# EAGLE design Stenophone (EAGLE 7.4.0)
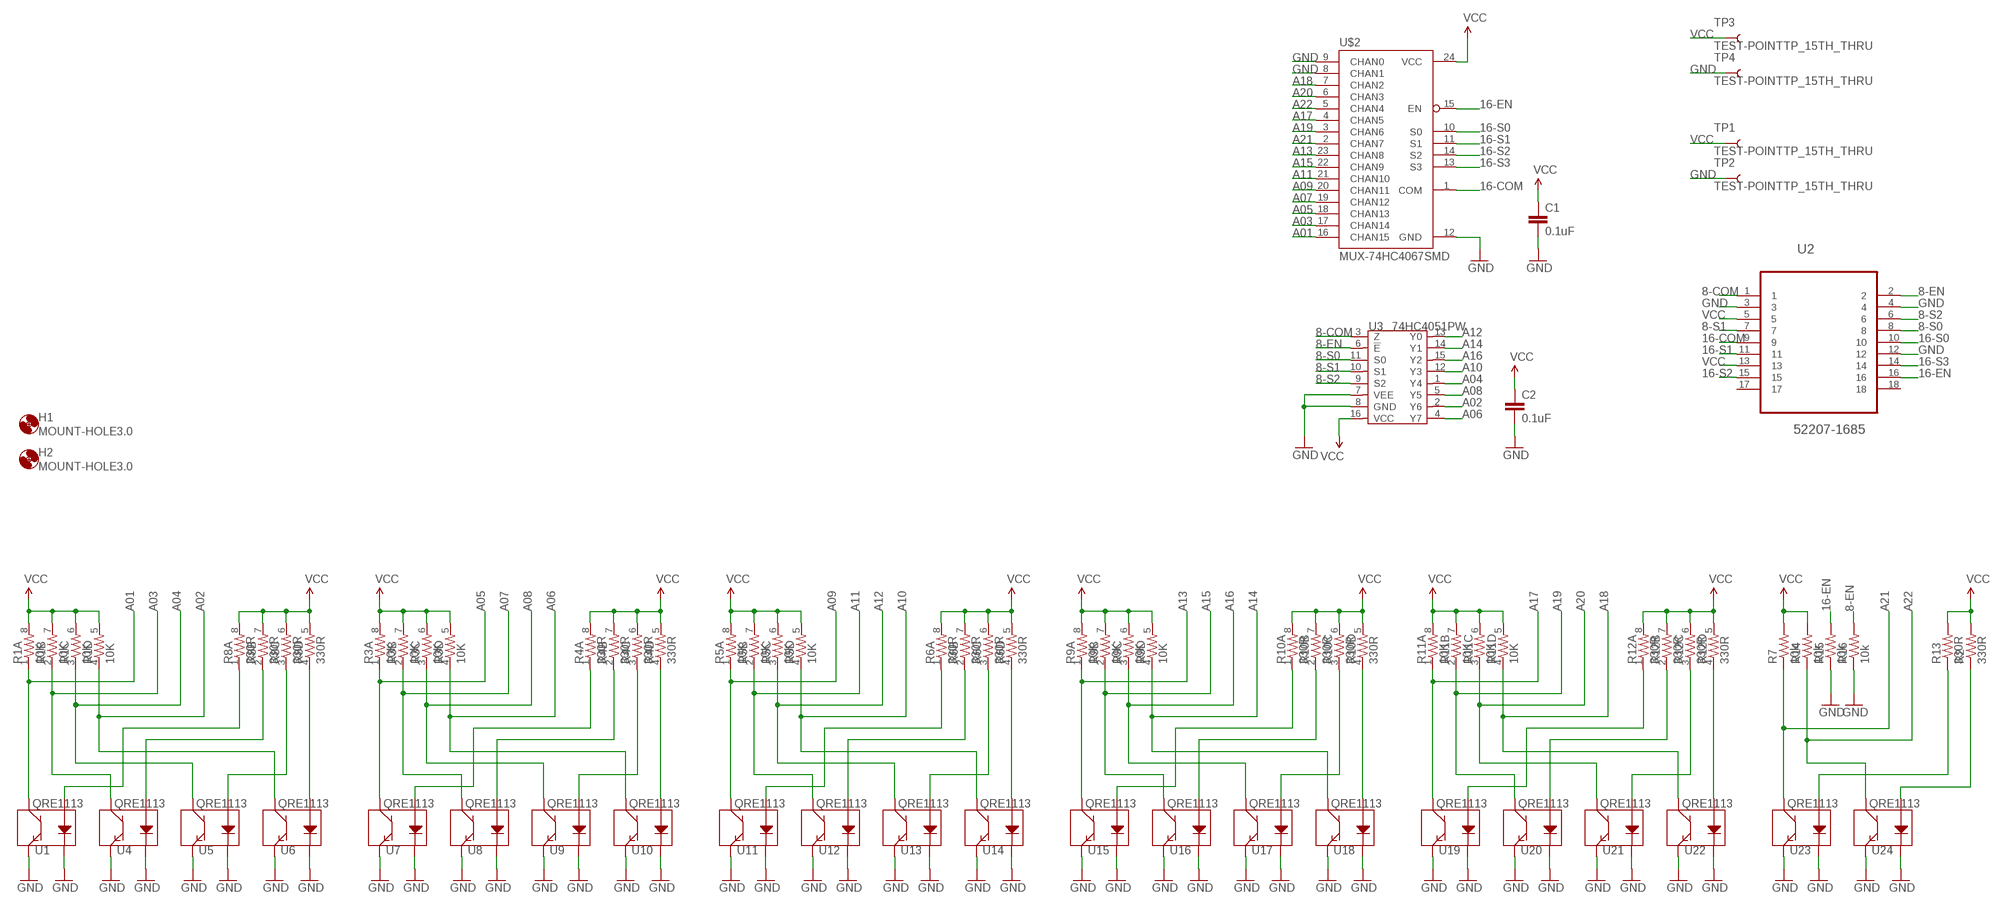
[diagram p0: schematic, sheet 1]

## Parts
C1  0.1uF  CAP0603-CAP  [0603-CAP]
C2  0.1uF  CAP0603-CAP  [0603-CAP]
H1  MOUNT-HOLE3.0  [3,0]
H2  MOUNT-HOLE3.0  [3,0]
R1  10K  RESISTOR-ARRAY0603-ARV  [0603-ARV]
R2  330R  RESISTOR0603-RES  [0603-RES]
R3  10K  RESISTOR-ARRAY0603-ARV  [0603-ARV]
R4  330R  RESISTOR-ARRAY0603-ARV  [0603-ARV]
R5  10K  RESISTOR-ARRAY0603-ARV  [0603-ARV]
R6  330R  RESISTOR-ARRAY0603-ARV  [0603-ARV]
R7  10k  RESISTOR0603-RES  [0603-RES]
R8  330R  RESISTOR-ARRAY0603-ARV  [0603-ARV]
R9  10K  RESISTOR-ARRAY0603-ARV  [0603-ARV]
R10  330R  RESISTOR-ARRAY0603-ARV  [0603-ARV]
R11  10K  RESISTOR-ARRAY0603-ARV  [0603-ARV]
R12  330R  RESISTOR-ARRAY0603-ARV  [0603-ARV]
R13  330R  RESISTOR0603-RES  [0603-RES]
R14  10k  RESISTOR0603-RES  [0603-RES]
R15  10k  RESISTOR0603-RES  [0603-RES]
R16  10k  RESISTOR0603-RES  [0603-RES]
TP1  TEST-POINTTP_15TH_THRU  [TP_15TH]
TP2  TEST-POINTTP_15TH_THRU  [TP_15TH]
TP3  TEST-POINTTP_15TH_THRU  [TP_15TH]
TP4  TEST-POINTTP_15TH_THRU  [TP_15TH]
U1  QRE1113  [QRE1113]
U2  52207-1685  [MOLEX_52207-1685]
U3  74HC4051PW  [TSSOP16-6.6]
U4  QRE1113  [QRE1113]
U5  QRE1113  [QRE1113]
U6  QRE1113  [QRE1113]
U7  QRE1113  [QRE1113]
U8  QRE1113  [QRE1113]
U9  QRE1113  [QRE1113]
U10  QRE1113  [QRE1113]
U11  QRE1113  [QRE1113]
U12  QRE1113  [QRE1113]
U13  QRE1113  [QRE1113]
U14  QRE1113  [QRE1113]
U15  QRE1113  [QRE1113]
U16  QRE1113  [QRE1113]
U17  QRE1113  [QRE1113]
U18  QRE1113  [QRE1113]
U19  QRE1113  [QRE1113]
U20  QRE1113  [QRE1113]
U21  QRE1113  [QRE1113]
U22  QRE1113  [QRE1113]
U23  QRE1113  [QRE1113]
U24  QRE1113  [QRE1113]
U$2  MUX-74HC4067SMD  [SSOP24]

## Nets
8-COM: U2.1 U3.3(Z)
8-EN: R16.2 U2.2 U3.6(!E)
8-S0: U2.8 U3.11(S0)
8-S1: U2.7 U3.10(S1)
8-S2: U2.6 U3.9(S2)
16-COM: U2.9 U$2.1(COM)
16-EN: R15.2 U2.16 U$2.15(EN)
16-S0: U2.10 U$2.10(S0)
16-S1: U2.11 U$2.11(S1)
16-S2: U2.15 U$2.14(S2)
16-S3: U2.14 U$2.13(S3)
A01: R1.1 U1.3(C) U$2.16(CHAN15)
A02: R1.4 U3.2(Y6) U6.3(C)
A03: R1.2 U4.3(C) U$2.17(CHAN14)
A04: R1.3 U3.1(Y4) U5.3(C)
A05: R3.1 U7.3(C) U$2.18(CHAN13)
A06: R3.4 U3.4(Y7) U10.3(C)
A07: R3.2 U8.3(C) U$2.19(CHAN12)
A08: R3.3 U3.5(Y5) U9.3(C)
A09: R5.1 U11.3(C) U$2.20(CHAN11)
A10: R5.4 U3.12(Y3) U14.3(C)
A11: R5.2 U12.3(C) U$2.21(CHAN10)
A12: R5.3 U3.13(Y0) U13.3(C)
A13: R9.1 U15.3(C) U$2.23(CHAN8)
A14: R9.4 U3.14(Y1) U18.3(C)
A15: R9.2 U16.3(C) U$2.22(CHAN9)
A16: R9.3 U3.15(Y2) U17.3(C)
A17: R11.1 U19.3(C) U$2.4(CHAN5)
A18: R11.4 U22.3(C) U$2.7(CHAN2)
A19: R11.2 U20.3(C) U$2.3(CHAN6)
A20: R11.3 U21.3(C) U$2.6(CHAN3)
A21: R7.1 U23.3(C) U$2.2(CHAN7)
A22: R14.1 U24.3(C) U$2.5(CHAN4)
GND: C1.2 C2.2 R15.1 R16.1 TP2.P$1 TP4.P$1 U1.2(K) U1.4(E) U2.3 U2.4 U2.12 U3.7(VEE) U3.8(GND) U4.2(K) U4.4(E) U5.2(K) U5.4(E) U6.2(K) U6.4(E) U7.2(K) U7.4(E) U8.2(K) U8.4(E) U9.2(K) U9.4(E) U10.2(K) U10.4(E) U11.2(K) U11.4(E) U12.2(K) U12.4(E) U13.2(K) U13.4(E) U14.2(K) U14.4(E) U15.2(K) U15.4(E) U16.2(K) U16.4(E) U17.2(K) U17.4(E) U18.2(K) U18.4(E) U19.2(K) U19.4(E) U20.2(K) U20.4(E) U21.2(K) U21.4(E) U22.2(K) U22.4(E) U23.2(K) U23.4(E) U24.2(K) U24.4(E) U$2.8(CHAN1) U$2.9(CHAN0) U$2.12(GND)
N$5: R8.4 U6.1(A)
N$6: R8.3 U5.1(A)
N$7: R8.1 U1.1(A)
N$8: R8.2 U4.1(A)
N$13: R4.4 U10.1(A)
N$14: R4.3 U9.1(A)
N$15: R4.1 U7.1(A)
N$16: R4.2 U8.1(A)
N$21: R6.4 U14.1(A)
N$22: R6.3 U13.1(A)
N$23: R6.1 U11.1(A)
N$24: R6.2 U12.1(A)
N$29: R10.4 U18.1(A)
N$30: R10.3 U17.1(A)
N$31: R10.1 U15.1(A)
N$32: R10.2 U16.1(A)
N$37: R12.4 U22.1(A)
N$38: R12.3 U21.1(A)
N$39: R12.1 U19.1(A)
N$40: R12.2 U20.1(A)
N$43: R2.1 U24.1(A)
N$44: R13.1 U23.1(A)
VCC: C1.1 C2.1 R1.5 R1.6 R1.7 R1.8 R2.2 R3.5 R3.6 R3.7 R3.8 R4.5 R4.6 R4.7 R4.8 R5.5 R5.6 R5.7 R5.8 R6.5 R6.6 R6.7 R6.8 R7.2 R8.5 R8.6 R8.7 R8.8 R9.5 R9.6 R9.7 R9.8 R10.5 R10.6 R10.7 R10.8 R11.5 R11.6 R11.7 R11.8 R12.5 R12.6 R12.7 R12.8 R13.2 R14.2 TP1.P$1 TP3.P$1 U2.5 U2.13 U3.16(VCC) U$2.24(VCC)
Unconnected: U2.17 U2.18

## Library data of the parts
C1 C2 = SparkFun-Passives:CAP: Capacitor Standard 0603 ceramic capacitor, and 0.1" leaded capacitor.
H1 H2 = holes:MOUNT-HOLE: MOUNTING HOLE with drill center marker
R1 R3-R6 R8-R12 = SparkFun-Passives:RESISTOR-ARRAY: Array Chip Resistor Source: RS Component / Phycomp
R2 R7 R13-R16 = SparkFun-Passives:RESISTOR: Resistor Basic schematic elements and footprints for 0603, 1206, and PTH resistors.
TP1-TP4 = SparkFun-Passives:TEST-POINT: Bare copper test points for troubleshooting or ICT
U1 U4-U24 = SparkFun-Sensors:QRE1113: Reflective object sensor; PROD_ID: IC-09357
U2 = Molex_By_element14_Batch_1:52207-1685: SOCKET FPC, SMT, 1MM, 16WAY; MPN: 52207-1685; OC_FARNELL: 1079941; OC_NEWARK: 66K6176; PACKAGE: SOCKET FPC, SMT, 1MM, 16WAY; SUPPLIER: Molex
U3 = IC:74*4051: 8-channel analog multiplexer/demultipliexer http://www.nxp.com/documents/data_sheet/74HC_HCT4051.pdf
U$2 = SparkFun-AnalogIC:MUX-74HC4067: 16-channel analog MUX; PROD_ID: IC-08252

## Board
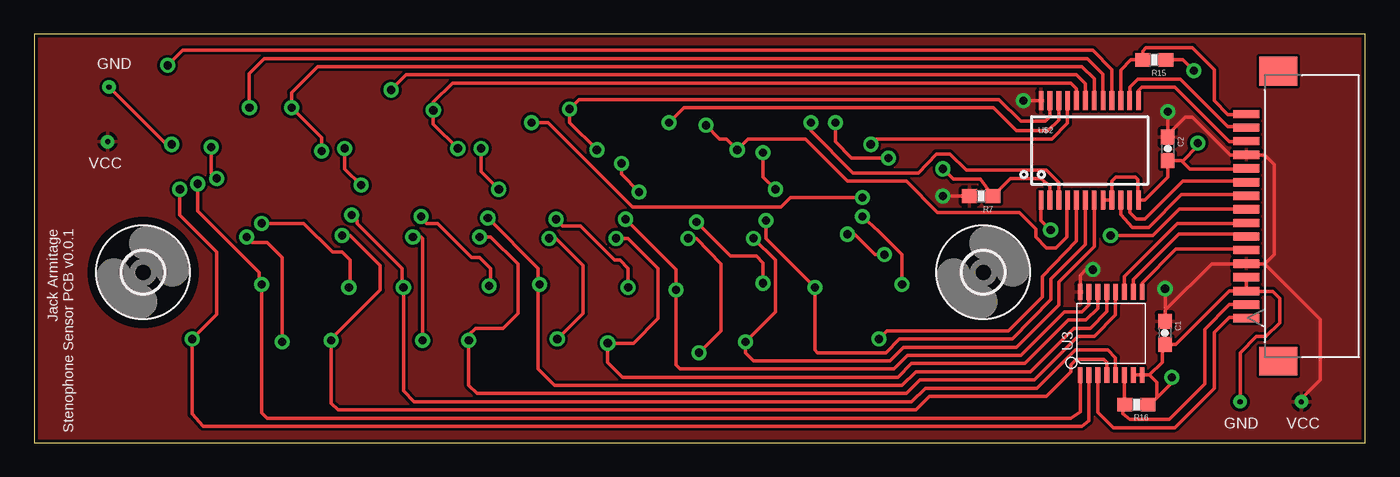
[diagram p1: board, top side]
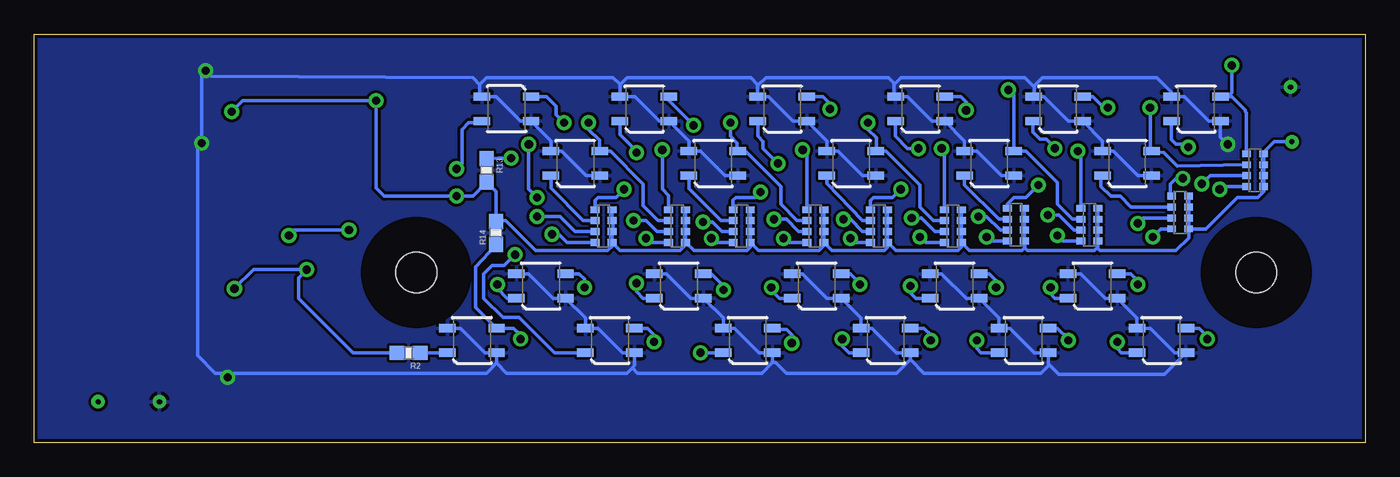
[diagram p2: board, bottom side, seen from below]

Size 97.7 x 30 mm. Coordinates in mm from the lower left corner, seen from the top.
Outline: 0,0 97.7,0 97.7,30 0,30 0,0
Copper layers (1*16): Top 0.035mm / dielectric 1.5mm / Bottom 0.035mm
Design rules "SparkFun": minimum track width 8mil, minimum drill 20mil, track to track 8mil, track to pad 8mil, pad to pad 8mil, via to via 8mil, smd to smd 8mil, copper to edge 10mil, drill to drill 8mil, minimum pad ring 12mil, minimum via ring 10mil, stop-mask expansion 4mil, vias tented up to drill 25mil, thermal gap 10mil

### Footprints (pad centres in the part's own frame; a part is rotated, then mirrored left to right if it is on the bottom)
0603-CAP = smd 1.1 x 1: 1 -0.85,0; 2 0.85,0
3,0 = hole 3: 0,0
0603-ARV = smd 0.5 x 0.65: 1 -1.2,-0.625; 2 -0.4,-0.625; 3 0.4,-0.625; 4 1.2,-0.625; 5 1.2,0.625; 6 0.4,0.625; 7 -0.4,0.625; 8 -1.2,0.625
0603-RES = smd 1.1 x 1: 1 -0.85,0; 2 0.85,0
TP_15TH = drill 0.381 pad 0.61: P$1 0,0
QRE1113 = smd 1.2 x 0.6: 1 -1.8,-0.9; 2 1.8,-0.9; 3 1.8,0.9; 4 -1.8,0.9
MOLEX_52207-1685 = smd 0.61 x 1.905: 1 7.493,4.801; 2 6.502,4.801; 3 5.512,4.801; 4 4.496,4.801; 5 3.505,4.801; 6 2.489,4.801; 7 1.499,4.801; 8 0.508,4.801; 9 -0.508,4.801; 10 -1.499,4.801; 11 -2.489,4.801; 12 -3.505,4.801; 13 -4.496,4.801; 14 -5.512,4.801; 15 -6.502,4.801; 16 -7.493,4.801 | smd 2.108 x 2.794: 17 -10.643,7.137; 18 10.643,7.137
TSSOP16-6.6 = smd 0.356 x 1.143: 1 -2.275,-3.052; 2 -1.625,-3.052; 3 -0.975,-3.052; 4 -0.325,-3.052; 5 0.325,-3.052; 6 0.975,-3.052; 7 1.625,-3.052; 8 2.275,-3.052; 9 2.275,3.052; 10 1.625,3.052; 11 0.975,3.052; 12 0.325,3.052; 13 -0.325,3.052; 14 -0.975,3.052; 15 -1.625,3.052; 16 -2.275,3.052
SSOP24 = smd 0.348 x 1.397: 1 -3.575,-3.656; 2 -2.925,-3.656; 3 -2.275,-3.656; 4 -1.625,-3.656; 5 -0.975,-3.656; 6 -0.325,-3.656; 7 0.325,-3.656; 8 0.975,-3.656; 9 1.625,-3.656; 10 2.275,-3.656; 11 2.925,-3.656; 12 3.575,-3.656; 13 3.575,3.656; 14 2.925,3.656; 15 2.275,3.656; 16 1.625,3.656; 17 0.975,3.656; 18 0.325,3.656; 19 -0.325,3.656; 20 -0.975,3.656; 21 -1.625,3.656; 22 -2.275,3.656; 23 -2.925,3.656; 24 -3.575,3.656

### Placement (x,y rotation side)
C1  82.99,8.06 270 top
C2  83.19,21.57 270 top
H1  69.65,12.5 0 top
H2  8,12.5 0 top
R1  8.1,20 270 bottom
R2  70.22,6.59 180 bottom
R3  20.25,16 270 bottom
R4  25.65,16 270 bottom
R5  30.27,15.9 270 bottom
R6  35.69,15.9 270 bottom
R7  69.5,18.1 180 top
R8  13.6,16.9 270 bottom
R9  40.37,15.9 270 bottom
R10  45.77,15.9 270 bottom
R11  50.51,15.9 270 bottom
R12  55.91,15.9 270 bottom
R13  64.49,19.99 270 bottom
R14  63.8,15.4 90 bottom
R15  82.2,28.1 180 top
R16  80.9,2.8 180 top
TP1  5.4,22.1 0 top
TP2  5.5,26.1 0 top
TP3  93,3 0 top
TP4  88.5,3 0 top
U1  12.43,24.5 0 bottom
U2  84.16,16.63 270 top
U3  79.04,8.01 0 top
U4  17.49,20.5 0 bottom
U5  20.02,11.5 0 bottom
U6  14.96,7.5 0 bottom
U7  22.55,24.5 0 bottom
U8  27.61,20.5 0 bottom
U9  30.14,11.5 0 bottom
U10  25.08,7.5 0 bottom
U11  32.67,24.5 0 bottom
U12  37.73,20.5 0 bottom
U13  40.26,11.5 0 bottom
U14  35.2,7.5 0 bottom
U15  42.79,24.5 0 bottom
U16  47.85,20.5 0 bottom
U17  50.38,11.5 0 bottom
U18  45.32,7.5 0 bottom
U19  52.91,24.5 0 bottom
U20  57.97,20.5 0 bottom
U21  60.5,11.5 0 bottom
U22  55.44,7.5 0 bottom
U23  63.03,24.5 180 bottom
U24  65.56,7.5 0 bottom
U$2  77.47,21.45 0 top

### Tracks (layer width: path | path; a pad name or v marks a point on that pad's centre or on a via)
8-COM
  Top 0.25: U3.3 78.06,2.23 79.2,1.1 83.7,1.1 86.6,4 86.6,8.1 87.7,9.2 88.9,9.2 U2.1
8-EN
  Top 0.25: U3.6 80.02,2.83 R16.2 79.9,2.65 79.9,2.1 80.4,1.7 83.3,1.7 85.9,4.3 85.9,8.3 87.73,10.13 U2.2
8-S0
  Top 0.25: U3.11 80.02,12.21 83.9,16.1 88.94,16.1 U2.8
8-S1
  Top 0.25: U3.10 80.67,11.96 84,15.3 88.79,15.3 U2.7
8-S2
  Top 0.25: U3.9 81.31,11.71 83.8,14.2 88.9,14.2 U2.6
16-COM  (via drill 0.6 pad 0.4)
  Top 0.25: U2.9 84.04,17.14 82.1,15.2 v79,15.2 | U$2.1 73.89,16.41 73.9,16.3 v74.6,15.6
  Bottom 0.25: v74.6,15.6 78.6,15.6 v79,15.2
16-EN
  Top 0.25: U$2.15 79.75,27.34 80.5,28.1 R15.2 81.35,28.75 81.6,29 85,29 86.6,27.4 86.6,25.1 87.6,24.1 88.94,24.1 U2.16
16-S0
  Top 0.25: U$2.10 79.75,16.75 80.6,15.8 81.8,15.8 84.2,18.2 88.89,18.2 U2.10
16-S1
  Top 0.25: U$2.11 80.39,16.91 80.9,16.4 81.5,16.4 84.3,19.2 88.88,19.2 U2.11
16-S2
  Top 0.25: U$2.14 80.39,26.09 81,26.7 84.1,26.7 87.6,23.2 88.89,23.2 U2.15
16-S3
  Top 0.25: U$2.13 81.05,25.84 81.3,26.1 83.7,26.1 87.7,22.1 88.92,22.1 U2.14
A01  (via drill 0.6 pad 0.4)
  Top 0.25: U$2.16 79.1,27.4 77.7,28.8 10.9,28.8 v9.8,27.7
  Bottom 0.25: R1.1 8.72,24.23 8.8,24.3 8.8,24.4 9.8,25.4 10.1,25.4 | 10.1,25.4 U1.3 | v9.8,27.7 9.8,25.7 10.1,25.4
A02  (via drill 0.6 pad 0.4)
  Top 0.25: U3.2 77.4,4.96 77.4,1.6 76.9,1.2 12.4,1.2 11.6,2.1 v11.6,7.6 | v11.6,7.6 11.6,7.4 | v10.7,18.6 10.7,16.7 13.4,14 13.4,9.4 v11.6,7.6
  Bottom 0.25: U6.3 12.2,8.4 11.6,7.8 v11.6,7.6 | R1.4 10.5,18.8 v10.7,18.6
A03  (via drill 0.6 pad 0.4)
  Top 0.25: U$2.17 78.44,27.05 77.3,28.2 16.9,28.2 15.8,27.1 v15.8,24.6
  Bottom 0.25: R1.2 13.8,20.3 14.8,21.3 U4.3 15.8,21.51 v15.8,24.6
A04  (via drill 0.6 pad 0.4)
  Top 0.25: U3.1 76.77,2.27 76.1,1.8 17.1,1.8 16.7,2.2 v16.7,11.6 | v16.7,11.6 16.7,11.4 | v12,19 12,17 16.5,12.5 16.5,11.8 v16.7,11.6
  Bottom 0.25: U5.3 17.2,12.4 16.7,11.9 v16.7,11.6 | R1.3 11.4,19.6 v12,19
A05  (via drill 0.6 pad 0.4)
  Top 0.25: U$2.18 77.8,26.7 76.9,27.6 20.8,27.6 18.9,25.7 v18.9,24.6 21.1,22.4 v21.1,21.4
  Bottom 0.25: v18.9,24.6 19.2,24.6 20,25.4 U7.3 | R3.1 20.88,21.18 v21.1,21.4
A06  (via drill 0.6 pad 0.4)
  Top 0.25: U3.4 78.72,5.88 78.5,6.1 76.5,6.1 76.1,5.7 76.1,5.2 74.3,3.4 65.7,3.4 64.7,2.4 22.3,2.4 21.8,2.9 v21.8,7.5 21.8,7.6 25.4,11.2 25.4,13 23.2,15.2 v22.6,15.2
  Bottom 0.25: R3.4 22.2,14.8 v22.6,15.2 | U10.3 22.6,8.4 21.8,7.6 v21.8,7.5
A07  (via drill 0.6 pad 0.4)
  Top 0.25: U$2.19 77.14,26.36 76.5,27 27.3,27 v26.2,25.9
  Bottom 0.25: R3.2 21.5,16.4 22.6,17.5 22.6,19.1 24.9,21.4 U8.3 25.8,21.41 25.8,25.5 v26.2,25.9
A08  (via drill 0.6 pad 0.4)
  Top 0.25: U3.5 79.36,6.24 78.8,6.8 76.4,6.8 73.6,4 65.4,4 64.4,3 27.9,3 27.1,3.8 v27.1,11.4 | v23.3,16.7 23.7,16.3 23.7,16.1 27,12.8 27,11.5 v27.1,11.4 | v27.1,11.4 27.1,11.1
  Bottom 0.25: R3.3 21.4,15.6 22.5,16.7 v23.3,16.7 | U9.3 27.6,12.4 27.1,11.9 v27.1,11.4
A09  (via drill 0.6 pad 0.4)
  Top 0.25: U$2.20 76.5,26 76.1,26.4 30.7,26.4 29.3,25 v29.3,24.4 29.3,23.4 v31.1,21.6
  Bottom 0.25: R5.1 30.89,21.39 v31.1,21.6 | v29.3,24.4 29.3,25 29.7,25.4 U11.3
A10  (via drill 0.6 pad 0.4)
  Top 0.25: U3.12 79.36,9.37 77.8,7.8 76.6,7.8 73.4,4.6 65,4.6 64,3.6 32.5,3.6 31.9,4.2 v31.9,7.5 31.9,7.9 32.4,8.4 34.4,8.4 35.5,9.5 35.5,13.1 33.5,15.1 v32.7,15.1
  Bottom 0.25: R5.4 32.3,14.7 v32.7,15.1 | U14.3 32.4,8.4 31.9,7.9 v31.9,7.5
A11  (via drill 0.6 pad 0.4)
  Top 0.25: U$2.21 75.84,23.45 74.7,22.3 61.8,22.3 v61.4,21.9 | v60.8,18 55.5,18 54.8,17.3 43.9,17.3 37.7,23.5 v36.5,23.5
  Bottom 0.25: R5.2 31.7,16.3 32.7,17.3 32.7,18.9 35.2,21.4 U12.3 35.9,21.43 35.9,22.4 36.5,23 v36.5,23.5 | v61.4,21.9 61.4,18.6 v60.8,18
A12  (via drill 0.6 pad 0.4)
  Top 0.25: U3.13 78.72,9.62 77.5,8.4 76.3,8.4 73.1,5.2 64.7,5.2 63.7,4.2 38.2,4.2 37,5.4 37,11.5 v37.1,11.6 | v37.1,11.6 37.1,11.2 | v33.3,16.5 37,12.8 37,11.7 v37.1,11.6
  Bottom 0.25: R5.3 31.6,15.5 32.6,16.5 v33.3,16.5 | U13.3 37.8,12.4 37.1,11.7 v37.1,11.6
A13  (via drill 0.6 pad 0.4)
  Top 0.25: U$2.23 74.55,23.95 74.2,23.6 72.4,23.6 70.8,25.2 40,25.2 v39.3,24.5 39.3,23.5 v41.3,21.5
  Bottom 0.25: R9.1 40.99,21.2 v41.3,21.5 | v39.3,24.5 39.3,24.9 39.8,25.4 U15.3
A14  (via drill 0.6 pad 0.4)
  Top 0.25: U3.14 78.06,9.87 77.2,9 75.9,9 72.7,5.8 64.4,5.8 63.4,4.8 43.2,4.8 42.1,5.9 v42.1,7.3 44,7.3 45.8,9.1 45.8,12.8 43.6,15 v42.7,15
  Bottom 0.25: R9.4 42.4,14.7 v42.7,15 | v42.1,7.3 42.1,7.9 42.5,8.3 43.42,8.3 U18.3
A15  (via drill 0.6 pad 0.4)
  Top 0.25: U$2.22 75.19,23.7 74.4,22.9 72.1,22.9 70.4,24.6 47.7,24.6 v46.6,23.5
  Bottom 0.25: R9.2 41.7,16.3 42.9,17.5 42.9,18.8 45.5,21.4 U16.3 46.1,21.45 46.1,22 46.6,22.5 v46.6,23.5
A16  (via drill 0.6 pad 0.4)
  Top 0.25: U3.15 77.42,10.12 76.9,9.6 75.6,9.6 72.4,6.4 64.1,6.4 63.1,5.4 47.4,5.4 47.1,5.7 v47.1,11.2 47.1,12.7 v43.4,16.4
  Bottom 0.25: R9.3 41.6,15.5 42.5,16.4 v43.4,16.4 | v47.1,11.2 47.1,11.5 48,12.4 U17.3
A17  (via drill 0.6 pad 0.4)
  Top 0.25: v49.3,23.3 50.3,22.3 50.8,22.3 v51.6,21.5 52.4,22.3 56.6,22.3 59.7,19.2 64,19.2 66.3,16.9 72.3,16.9 73.5,15.7 73.5,15.1 74.3,14.3 75,14.3 75.8,15.1 75.8,17.79 U$2.4
  Bottom 0.25: v49.3,23.3 51.11,25.1 U19.3 | R11.1 51.13,18.14 51.6,18.6 v51.6,21.5
A18  (via drill 0.6 pad 0.4)
  Top 0.25: U$2.7 77.8,14.39 75.2,11.8 75.2,10.1 72.1,7 63.8,7 62.8,6 52.8,6 52.2,6.6 v52.2,7.4 54.4,9.6 54.4,13.4 v52.8,15
  Bottom 0.25: v52.2,7.4 52.2,7.9 52.7,8.4 U22.3 | R11.4 52.5,14.7 v52.8,15
A19  (via drill 0.6 pad 0.4)
  Top 0.25: U$2.3 75.19,19.11 74.3,20 68.4,20 67.2,21.2 66.2,21.2 64.9,19.8 60.1,19.8 57,22.9 v57,23.5
  Bottom 0.25: R11.2 51.9,16.3 53,17.4 53,19 55.4,21.4 U20.3 56.2,21.43 56.2,22.2 57,23 v57,23.5
A20  (via drill 0.6 pad 0.4)
  Top 0.25: U$2.6 77.14,14.54 74.6,12 74.6,10.5 71.8,7.6 63.5,7.6 62.5,6.6 57.5,6.6 57.3,6.8 v57.3,11.4 53.7,15 v53.7,16.3
  Bottom 0.25: v57.3,11.4 57.3,12 57.7,12.4 U21.3 | R11.3 52,15.5 52.8,16.3 v53.7,16.3
A21  (via drill 0.6 pad 0.4)
  Top 0.25: U$2.2 74.55,18.86 73.9,19.4 71.65,19.4 R7.1 69.45,19.35 67.45,19.35 v66.7,20.1
  Bottom 0.25: v66.7,20.1 66.3,20.5 66.3,23 65.8,23.5 64.93,23.5 U23.3
A22  (via drill 0.6 pad 0.4)
  Top 0.25: U$2.5 76.5,14.79 74,12.2 74,10.7 71.5,8.2 62.6,8.2 v62,7.6
  Bottom 0.25: R14.1 63.8,14.5 65.3,12.9 65.3,9.94 U24.3 62.5,8.4 62,7.9 v62,7.6
GND  (via drill 0.6, 0.6 pad 0.4)
  Top 0.25: 81.86,4.96 U3.8 U3.7 | 81.86,4.96 82.8,5.9 82.8,7.02 C1.2 83.8,7.2 87.72,11.12 U2.3 | R16.1 81.9,2.8 82.4,3.3 | 82.4,3.3 82.4,4.42 81.86,4.96 | U2.3 U2.4 | 84.25,20.65 84.18,20.72 C2.2 83.2,19.5 81.49,17.79 U$2.12 81,17.84 81,19.3 80.8,19.5 79.4,19.5 79.09,19.2 U$2.9 U$2.8 | 84.25,20.65 84.8,20.1 88.92,20.1 U2.12 | R15.1 84.3,28.1 v85.1,27.3 | v85.4,22 85.4,21.8 84.25,20.65 | v83.5,4.8 83.5,4.4 82.4,3.3 | v10.1,21.9 9.7,21.9 TP2.P$1 | TP4.P$1 88.5,6.6 89.7,7.8 90.4,7.8 91.4,8.8 91.4,10.6 90.9,11.1 88.98,11.1 U2.3
  Bottom 0.25: U24.4 66.4,8.4 64.6,6.6 U24.2 63.76,5.84 | U21.4 61.4,12.4 59.6,10.6 U21.2 57.24,9.14 U22.4 56.3,8.4 54.5,6.6 U22.2 53.64,5.66 53.8,5.5 | U17.4 51.3,12.4 49.5,10.6 U17.2 47.12,9.14 U18.4 46.3,8.4 44.5,6.6 U18.2 43.52,5.88 | U19.4 53.6,25.4 51.8,23.6 U19.2 49.65,22.14 U16.4 48.8,21.4 47,19.6 U16.2 | U20.2 57.2,19.6 59,21.4 U20.4 59.77,22.14 U23.4 62,23.6 63.8,25.4 U23.2 65,25.57 65,26.3 | U13.4 41.3,12.4 39.5,10.6 U13.2 37,9.14 U14.4 36.2,8.4 34.4,6.6 U14.2 33.4,6.1 | U9.4 31.1,12.4 29.3,10.6 U9.2 26.88,9.14 U10.4 26.1,8.4 24.3,6.6 U10.2 23.28,5.78 23.2,5.7 | U5.4 20.9,12.4 19.1,10.6 U5.2 16.76,9.14 U6.4 15.8,8.4 14,6.6 U6.2 14.76,5 22.5,5 23.2,5.7 | U4.2 16.7,19.6 18.5,21.4 U4.4 19.29,22.14 U7.2 21.8,23.6 23.6,25.4 U7.4 24.3,25.45 24.3,26.1 | U8.2 26.7,19.6 28.5,21.4 U8.4 29.41,22.14 U11.2 31.8,23.6 33.6,25.4 U11.4 34.6,25.53 34.6,26.3 | U12.2 36.9,19.6 38.7,21.4 U12.4 39.53,22.14 U15.2 42,23.6 43.8,25.4 U15.4 44.6,26.2 | 33.4,6.1 32.4,5.1 23.8,5.1 23.2,5.7 | 33.4,6.1 34.41,5.1 42.5,5.1 43.28,5.88 43.52,5.88 | 43.52,5.88 44.3,5.1 53.4,5.1 53.8,5.5 | 53.8,5.5 54.2,5.1 63.03,5.1 63.76,5.84 | 24.3,26.1 25,26.8 34.1,26.8 34.6,26.3 | 24.3,26.1 24.3,26.2 23.7,26.8 15.3,26.8 14.23,25.73 U1.4 13.3,25.4 11.5,23.6 U1.2 10.63,22.43 v10.1,21.9 | 34.6,26.3 34.6,26.4 35,26.8 44,26.8 44.6,26.2 | 44.6,26.2 44.6,26.3 45.1,26.8 54.2,26.8 54.7,26.3 54.7,25.41 U19.4 | U19.4 54.71,26.31 55.2,26.8 64.5,26.8 65,26.3 | 63.76,5.84 64.5,5.1 83.5,5.1 | 83.5,5.1 84.4,5.1 85.7,6.4 85.7,21.7 v85.4,22 85.4,27 v85.1,27.3 84.7,26.9 65.5,26.8 65,26.3 | v83.5,4.8 83.5,5.1
  pour Bottom: 0,0 0,30 97.7,30 97.7,0
N$5  (via drill 0.6 pad 0.4)
  Top 0.25: 15.9,14.8 v15.6,15.1 16,14.7 17.1,14.7 18.2,13.6 v18.2,7.4 18.2,7.7
  Bottom 0.25: R8.4 15,15.7 v15.6,15.1 | U6.1 17.9,6.6 18.2,6.9 v18.2,7.4
N$6  (via drill 0.6 pad 0.4)
  Top 0.25: 23.1,11.6 v23.1,11.4 23.2,11.5 23.2,13.4 22.6,14 21.9,14 19.8,16.1 v16.7,16.1
  Bottom 0.25: R8.3 16.3,16.5 v16.7,16.1 | U5.1 22.8,10.6 23.1,10.9 v23.1,11.4
N$7  (via drill 0.6 pad 0.4)
  Top 0.25: v13,21.7 13,19.8 v13.4,19.4
  Bottom 0.25: U1.1 14.23,22.23 13.9,21.9 13.2,21.9 v13,21.7 | v13.4,19.4 13.9,19.4 14.3,19 14.3,18.18 R8.1
N$8
  Bottom 0.25: R8.2 17.2,17.3 18,18.1 18.7,18.1 19.4,18.8 19.4,19.49 U4.1
N$13  (via drill 0.6 pad 0.4)
  Top 0.25: v27.8,15.1 28.4,15.1 28.5,15 v28.5,7.5
  Bottom 0.25: R4.4 27.5,14.8 v27.8,15.1 | U10.1 28.2,6.6 28.5,6.9 v28.5,7.5
N$14  (via drill 0.6 pad 0.4)
  Top 0.25: v28.4,16.6 28.4,16.5 28.8,16.1 29.6,16.1 32.1,13.6 32.7,13.6 33.5,12.8 33.5,11.6 v33.4,11.5 33.4,11.8
  Bottom 0.25: R4.3 26.8,15.6 27.8,16.6 v28.4,16.6 | U9.1 33,10.6 33.4,11 v33.4,11.5
N$15  (via drill 0.6 pad 0.4)
  Top 0.25: v24,18.9 22.8,20.1 v22.8,21.6
  Bottom 0.25: R4.1 26.27,17.52 25.8,18 24.9,18 v24,18.9 | v22.8,21.6 22.8,21.7 23.4,22.3 23.9,22.3 24.4,22.8 24.4,23.55 U7.1
N$16
  Bottom 0.25: U8.1 29.41,18.91 26.9,16.4 R4.2
N$21  (via drill 0.6 pad 0.4)
  Top 0.25: 38.1,15 v37.8,15 38.3,15 40.3,13 40.3,9.5 v38.4,7.6 38.4,7.8
  Bottom 0.25: R6.4 37.5,14.7 v37.8,15 | U14.1 37.9,6.6 38.4,7.1 v38.4,7.6
N$22  (via drill 0.6 pad 0.4)
  Top 0.25: v38.3,16.4 38.8,15.9 40.1,15.9 42.6,13.4 43,13.4 43.6,12.8 v43.6,11.4
  Bottom 0.25: R6.3 36.9,15.5 37.8,16.4 v38.3,16.4 | U13.1 43,10.6 43.6,11.2 v43.6,11.4
N$23  (via drill 0.6 pad 0.4)
  Top 0.25: v34.1,18.6 32.8,19.9 v32.8,21.6
  Bottom 0.25: R6.1 36.31,17.79 36.1,18 34.7,18 v34.1,18.6 | v32.8,21.6 33.6,21.6 34.5,22.5 34.5,23.57 U11.1
N$24
  Bottom 0.25: U12.1 39.53,19.03 36.9,16.3 R6.2
N$29  (via drill 0.6 pad 0.4)
  Top 0.25: v48,15 48.6,15 50.4,13.1 50.4,8.2 v48.8,6.6
  Bottom 0.25: R10.4 47.7,14.7 v48,15 | v48.8,6.6 U18.1
N$30  (via drill 0.6 pad 0.4)
  Top 0.25: v48.6,16.2 51.1,13.7 53,13.7 53.5,13.2 v53.5,11.7
  Bottom 0.25: R10.3 47.2,15.5 47.9,16.2 v48.6,16.2 | v53.5,11.7 53.5,11.1 53,10.6 U17.1
N$31  (via drill 0.6 pad 0.4)
  Top 0.25: 44.3,18.5 v44.4,18.4 43.1,19.7 v43.1,20.5
  Bottom 0.25: R10.1 46.4,17.8 46.2,18 44.8,18 v44.4,18.4 | U15.1 44.59,22.49 44.2,22.1 44.2,21.6 v43.1,20.5
N$32
  Bottom 0.25: U16.1 49.65,18.65 47.3,16.3 R10.2
N$37  (via drill 0.6 pad 0.4)
  Top 0.25: v59.7,15.3 60.2,15.3 61.7,13.8 v62.4,13.8
  Bottom 0.25: R12.4 58.6,14.7 59.2,15.3 v59.7,15.3 | U22.1 59.5,6.6 62.1,9.2 63.3,9.2 64.7,10.6 64.7,12.4 64.1,13 63.2,13 v62.4,13.8
N$38  (via drill 0.6 pad 0.4)
  Top 0.25: v60.8,16.6 62,15.5 63.7,13.8 v63.7,11.6
  Bottom 0.25: R12.3 58,15.5 59.1,16.6 v60.8,16.6 | v63.7,11.6 63.7,11.3 63,10.6 U21.1
N$39  (via drill 0.6 pad 0.4)
  Top 0.25: v54.4,18.6 53.5,19.5 v53.5,21.3
  Bottom 0.25: R12.1 56.53,17.77 56.3,18 55,18 v54.4,18.6 | v53.5,21.3 53.5,21.4 54.7,22.6 54.7,23.59 U19.1
N$40
  Bottom 0.25: U20.1 59.77,18.67 57.4,16.3 R12.2
N$43
  Bottom 0.25: U24.1 R2.1
N$44  (via drill 0.6 pad 0.4)
  Top 0.25: v58.8,23.5 58.8,22.1 60,20.9 v62.7,20.9
  Bottom 0.25: U23.1 60.1,25.4 59.4,24.7 59.4,24.1 v58.8,23.5 | v62.7,20.9 63.63,20.9 R13.1
VCC  (via drill 0.6 pad 0.4)
  Top 0.25: 83.1,9.8 86.42,13.12 U2.5 90.33,13.12 | 83.1,9.8 83,9.7 C1.1 | U3.16 76.77,12.27 77.2,12.7 v77.7,12.7 | v83,11.3 83,9.9 83.1,9.8 | U$2.24 73.01,25.11 v72.6,25.1 | v83.2,24.3 83.2,22.6 | C2.1 83.2,22.6 | 83.2,22.6 84.5,23.9 85,23.9 87.8,21.1 88.94,21.1 | 88.94,21.1 U2.13 | R7.2 v66.7,18.1 | 90.33,13.12 91,13.8 91,20.4 90.3,21.1 88.94,21.1 | TP3.P$1 93,3.2 94.4,4.6 94.4,9.05 90.33,13.12
  Bottom 0.25: v83,11.3 81.6,12.7 v77.7,12.7 78.3,12.1 78.3,10.6 74.29,6.59 R2.2 | v83.2,24.3 82.4,25.1 v72.6,25.1 72.6,18.7 72,18.1 v66.7,18.1 65.5,18.1 64.53,19.1 R13.2 63.8,18.43 R14.2 63.75,16.3 63.1,16.3 60.9,14.1 55.6,14.1 55.28,14.41 R12.5 | 19.7,14.3 19.62,14.38 R3.5 R3.6 R3.7 R3.8 | 19.7,14.3 19.9,14.1 24.8,14.1 25,14.3 25,14.78 R4.5 | R4.5 25.02,14.28 25.2,14.1 29.05,14.1 R5.5 | R5.5 29.64,14.36 29.9,14.1 34.47,14.1 R6.5 | R6.5 35.06,14.34 35.3,14.1 39.15,14.1 R9.5 | R9.5 39.74,14.46 40.1,14.1 44.55,14.1 R10.5 | R10.5 45.15,14.36 45.4,14.1 49.28,14.1 R11.5 | R11.5 49.88,14.52 50.3,14.1 54.69,14.1 R12.5 | R12.5 R12.6 55.28,15.52 55.2,15.6 55.2,16.21 R12.7 R12.8 | R11.5 R11.6 R11.7 R11.8 | R10.5 R10.6 R10.7 R10.8 | R9.5 R9.6 R9.7 R9.8 | R6.5 R6.6 R6.7 R6.8 | R5.5 R5.6 R5.7 R5.8 | R4.5 R4.6 R4.7 R4.8 | R8.5 12.97,15.03 13.9,14.1 19.5,14.1 19.7,14.3 | R8.5 11.7,15.7 9.4,18 7.9,18 7.47,18.43 R1.5 R1.6 R1.7 R1.8 7.47,21.32 6.7,22.1 TP1.P$1 | R8.5 R8.6 R8.7 R8.8
  pour Top: 0,0 0,30 97.7,30 97.7,0

### Text on the board
tNames: GND | VCC | Jack Armitage / Stenophone Sensor PCB v0.0.1 | GND | VCC